# Altium schematic sheet analog_voltage_outputs.schdoc
size A3; Organization: Altium Limited; Address1: L3, 12a Rodborough Rd; Address2: Frenchs Forest; Address3: NSW; Address4: Australia 2086
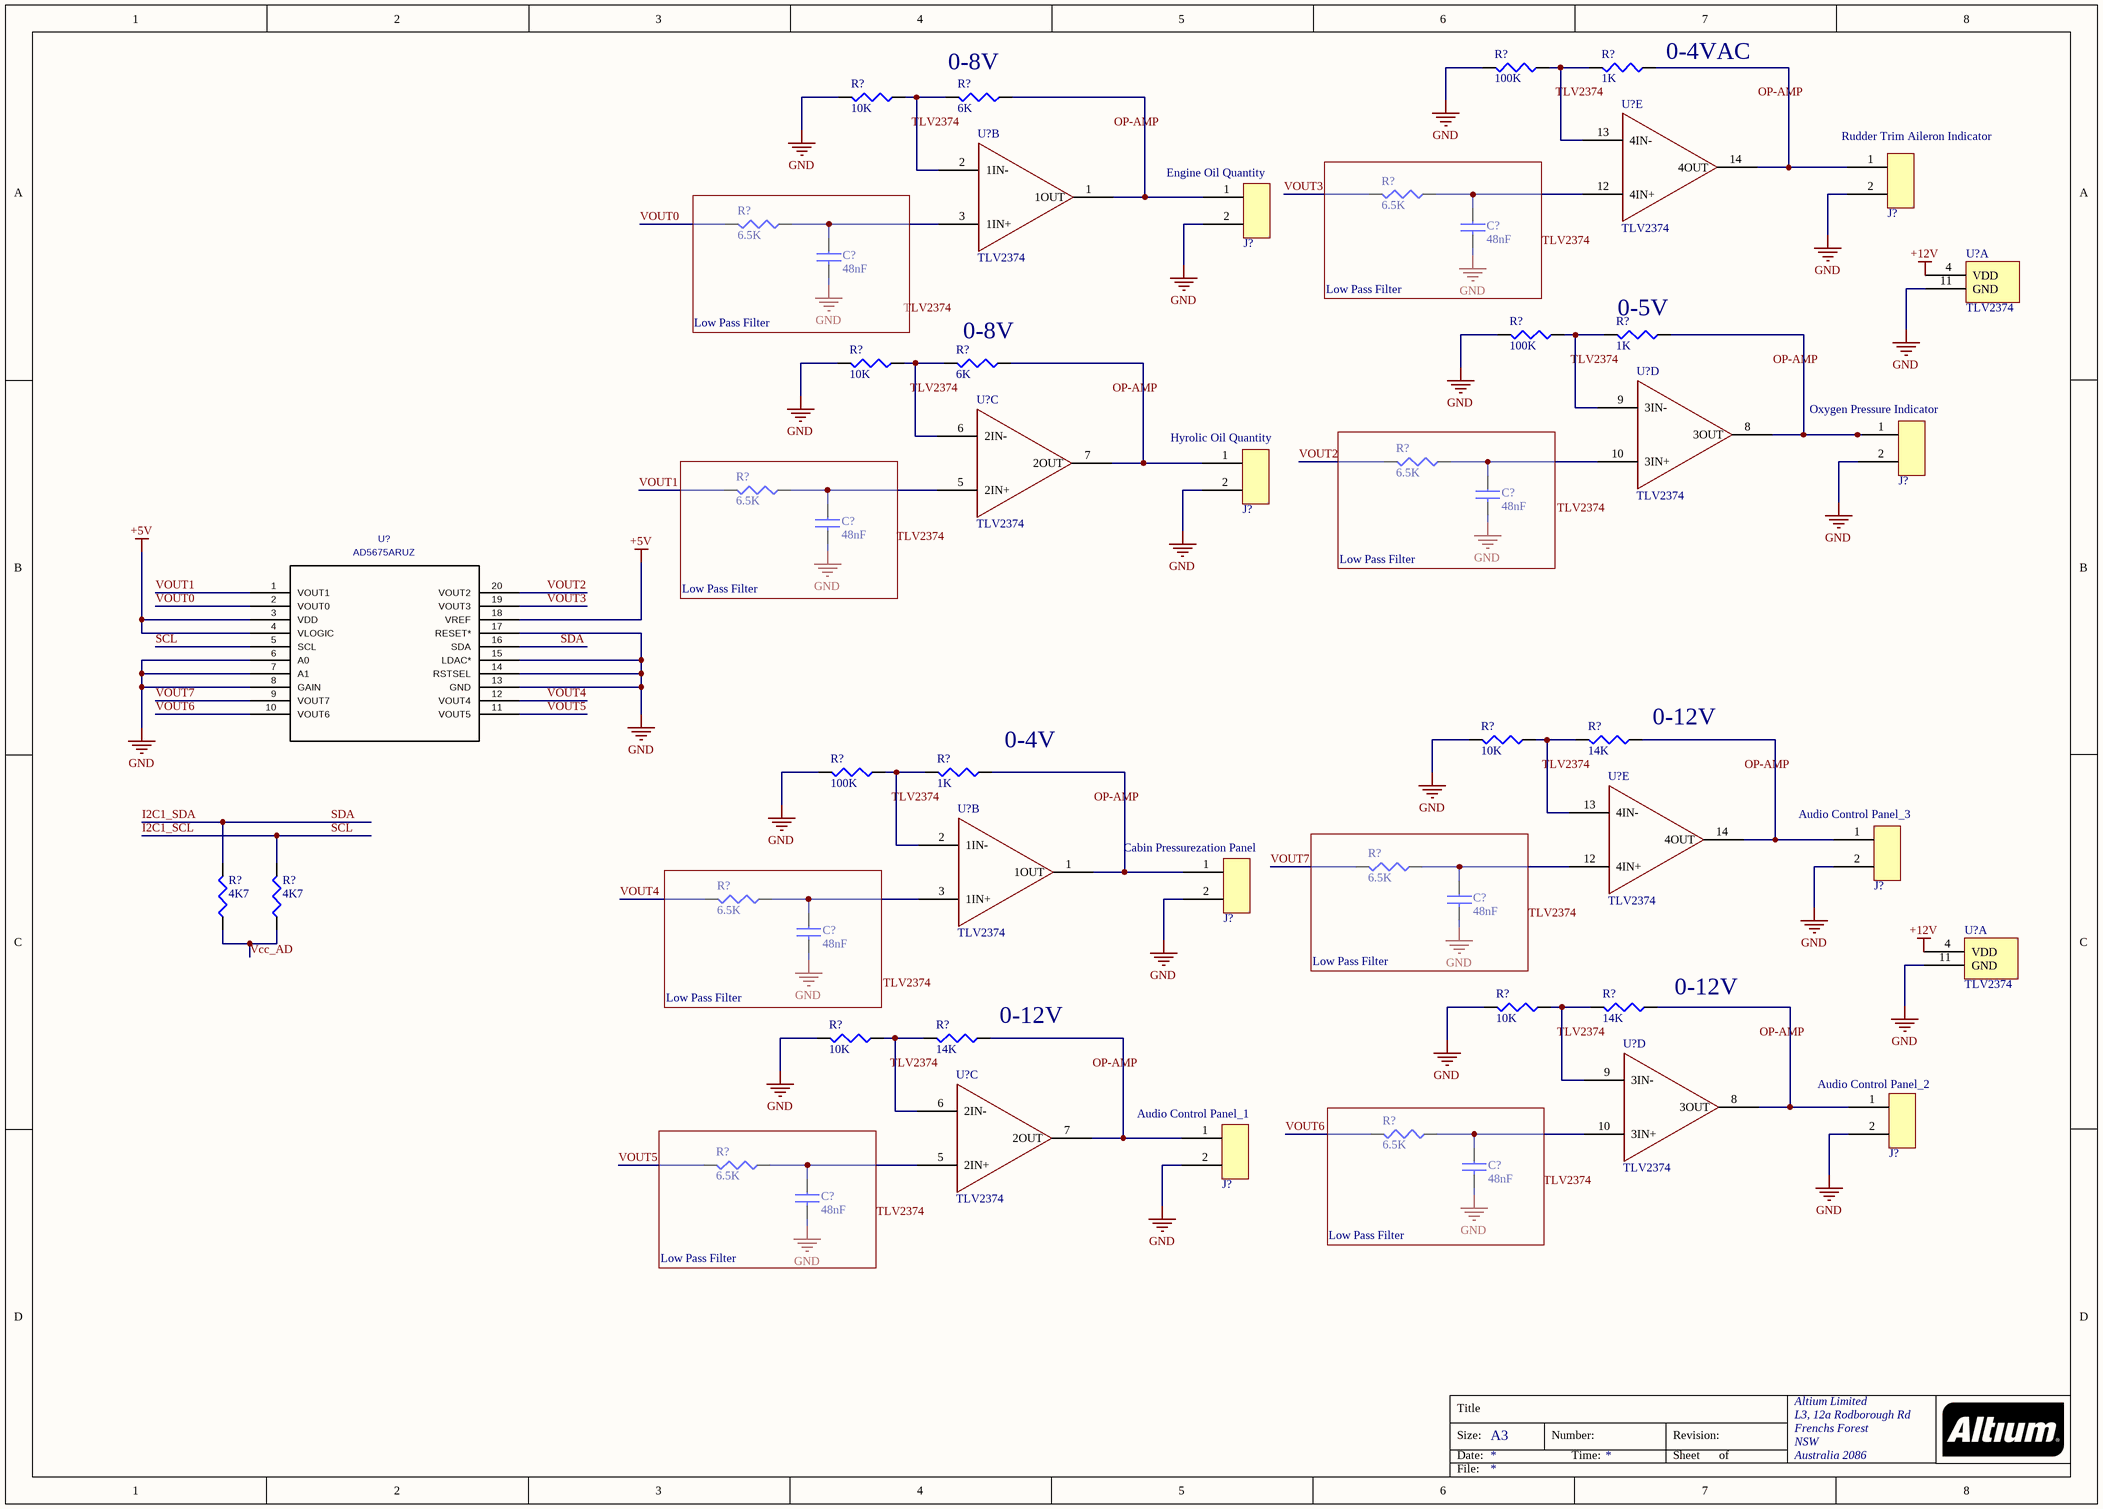
[diagram p0: analog_voltage_outputs.schdoc]

## Parts
(Parts that share a designator on the sheet are numbered #1, #2 ... from top to bottom, then left to right.)
C?#1  value 48nF  [0805 SMD Ceramic Capacitor]  (hidden comment: C0805C333)
C?#2  value 48nF  [0805 SMD Ceramic Capacitor]  (hidden comment: C0805C333)
C?#3  value 48nF  [0805 SMD Ceramic Capacitor]  (hidden comment: C0805C333)
C?#4  value 48nF  [0805 SMD Ceramic Capacitor]  (hidden comment: C0805C333)
C?#5  value 48nF  [0805 SMD Ceramic Capacitor]  (hidden comment: C0805C333)
C?#6  value 48nF  [0805 SMD Ceramic Capacitor]  (hidden comment: C0805C333)
C?#7  value 48nF  [0805 SMD Ceramic Capacitor]  (hidden comment: C0805C333)
C?#8  value 48nF  [0805 SMD Ceramic Capacitor]  (hidden comment: C0805C333)
J?#1  2x Terminal  [2x Terminal mini]  (value not drawn)
J?#2  2x Terminal  [2x Terminal mini]  (value not drawn)
J?#3  2x Terminal  [2x Terminal mini]  (value not drawn)
J?#4  2x Terminal  [2x Terminal mini]  (value not drawn)
J?#5  2x Terminal  [2x Terminal mini]  (value not drawn)
J?#6  2x Terminal  [2x Terminal mini]  (value not drawn)
J?#7  2x Terminal  [2x Terminal mini]  (value not drawn)
J?#8  2x Terminal  [2x Terminal mini]  (value not drawn)
R?#1  value 100K  [0805 Resistor]  (hidden comment: 0805_1K)
R?#2  value 1K  [0805 Resistor]  (hidden comment: 0805_1K)
R?#3  value 10K  [0805 Resistor]  (hidden comment: 0805_1K)
R?#4  value 6K  [0805 Resistor]  (hidden comment: 0805_1K)
R?#5  value 6.5K  [0805 Resistor]  (hidden comment: 0805_1K)
R?#6  value 6.5K  [0805 Resistor]  (hidden comment: 0805_1K)
R?#7  value 100K  [0805 Resistor]  (hidden comment: 0805_1K)
R?#8  value 1K  [0805 Resistor]  (hidden comment: 0805_1K)
R?#9  value 10K  [0805 Resistor]  (hidden comment: 0805_1K)
R?#10  value 6K  [0805 Resistor]  (hidden comment: 0805_1K)
R?#11  value 6.5K  [0805 Resistor]  (hidden comment: 0805_1K)
R?#12  value 6.5K  [0805 Resistor]  (hidden comment: 0805_1K)
R?#13  value 10K  [0805 Resistor]  (hidden comment: 0805_1K)
R?#14  value 14K  [0805 Resistor]  (hidden comment: 0805_1K)
R?#15  value 100K  [0805 Resistor]  (hidden comment: 0805_1K)
R?#16  value 1K  [0805 Resistor]  (hidden comment: 0805_1K)
R?#17  value 6.5K  [0805 Resistor]  (hidden comment: 0805_1K)
R?#18  value 6.5K  [0805 Resistor]  (hidden comment: 0805_1K)
R?#19  value 4K7  [0805 Resistor]  (hidden comment: 0805_4K7%1)
R?#20  value 4K7  [0805 Resistor]  (hidden comment: 0805_4K7%1)
R?#21  value 10K  [0805 Resistor]  (hidden comment: 0805_1K)
R?#22  value 14K  [0805 Resistor]  (hidden comment: 0805_1K)
R?#23  value 10K  [0805 Resistor]  (hidden comment: 0805_1K)
R?#24  value 14K  [0805 Resistor]  (hidden comment: 0805_1K)
R?#25  value 6.5K  [0805 Resistor]  (hidden comment: 0805_1K)
R?#26  value 6.5K  [0805 Resistor]  (hidden comment: 0805_1K)
U?#1  TLV2374  [SO14]  (part E of 5)
U?#2  TLV2374  [SO14]  (part B of 5)
U?#3  TLV2374  [SO14]  (part A of 5)
U?#4  TLV2374  [SO14]  (part D of 5)
U?#5  TLV2374  [SO14]  (part C of 5)
U?#6  AD5675ARUZ  [RU_20]
U?#7  TLV2374  [SO14]  (part E of 5)
U?#8  TLV2374  [SO14]  (part B of 5)
U?#9  TLV2374  [SO14]  (part A of 5)
U?#10  TLV2374  [SO14]  (part D of 5)
U?#11  TLV2374  [SO14]  (part C of 5)

## Blocks framed on the sheet
Low Pass Filter: C?#1 R?#5
Low Pass Filter: C?#2 R?#6
Low Pass Filter: C?#3 R?#11
Low Pass Filter: C?#4 R?#12
Low Pass Filter: C?#6 R?#18
Low Pass Filter: C?#5 R?#17
Low Pass Filter: C?#8 R?#26
Low Pass Filter: C?#7 R?#25

## Nets
+5V: U?#6.3(VDD) U?#6.4(VLOGIC) U?#6.18(VREF)
+12V: U?#3.4(VDD) U?#9.4(VDD)
GND: C?#1.2 C?#2.2 C?#3.2 C?#4.2 C?#5.2 C?#6.2 C?#7.2 C?#8.2 J?#1.2 J?#2.2 J?#3.2 J?#4.2 J?#5.2 J?#6.2 J?#7.2 J?#8.2 R?#1.2 R?#3.2 R?#7.2 R?#9.2 R?#13.2 R?#15.2 R?#21.2 R?#23.2 U?#3.11(GND) U?#6.6(A0) U?#6.7(A1) U?#6.8(GAIN) U?#6.13(GND) U?#6.14(RSTSEL) U?#6.15(LDAC*) U?#6.17(RESET*) U?#9.11(GND)
I2C1_SCL: R?#20.2 U?#6.5(SCL)  [also labelled SCL]
I2C1_SDA: R?#19.2 U?#6.16(SDA)  [also labelled SDA]
Vcc_AD: R?#19.1 R?#20.1
VOUT0: R?#6.2 U?#6.2(VOUT0)
VOUT1: R?#12.2 U?#6.1(VOUT1)
VOUT2: R?#11.2 U?#6.20(VOUT2)
VOUT3: R?#5.2 U?#6.19(VOUT3)
VOUT4: R?#18.2 U?#6.12(VOUT4)
VOUT5: R?#26.2 U?#6.11(VOUT5)
VOUT6: R?#25.2 U?#6.10(VOUT6)
VOUT7: R?#17.2 U?#6.9(VOUT7)
NetC?#1_1: C?#1.1 R?#5.1 U?#1.12(4IN+)
NetC?#2_1: C?#2.1 R?#6.1 U?#2.3(1IN+)
NetC?#3_1: C?#3.1 R?#11.1 U?#4.10(3IN+)
NetC?#4_1: C?#4.1 R?#12.1 U?#5.5(2IN+)
NetC?#5_1: C?#5.1 R?#17.1 U?#7.12(4IN+)
NetC?#6_1: C?#6.1 R?#18.1 U?#8.3(1IN+)
NetC?#7_1: C?#7.1 R?#25.1 U?#10.10(3IN+)
NetC?#8_1: C?#8.1 R?#26.1 U?#11.5(2IN+)
NetJ?#1_1: J?#1.1 R?#2.1 U?#1.14(4OUT)
NetJ?#2_1: J?#2.1 R?#4.1 U?#2.1(1OUT)
NetJ?#3_1: J?#3.1 R?#8.1 U?#4.8(3OUT)
NetJ?#4_1: J?#4.1 R?#10.1 U?#5.7(2OUT)
NetJ?#5_1: J?#5.1 R?#14.1 U?#7.14(4OUT)
NetJ?#6_1: J?#6.1 R?#16.1 U?#8.1(1OUT)
NetJ?#7_1: J?#7.1 R?#22.1 U?#10.8(3OUT)
NetJ?#8_1: J?#8.1 R?#24.1 U?#11.7(2OUT)
NetR?#1_1: R?#1.1 R?#2.2 U?#1.13(4IN-)
NetR?#3_1: R?#3.1 R?#4.2 U?#2.2(1IN-)
NetR?#7_1: R?#7.1 R?#8.2 U?#4.9(3IN-)
NetR?#9_1: R?#9.1 R?#10.2 U?#5.6(2IN-)
NetR?#13_1: R?#13.1 R?#14.2 U?#7.13(4IN-)
NetR?#15_1: R?#15.1 R?#16.2 U?#8.2(1IN-)
NetR?#21_1: R?#21.1 R?#22.2 U?#10.9(3IN-)
NetR?#23_1: R?#23.1 R?#24.2 U?#11.6(2IN-)

## Notes on the sheet
- (near R?#4) 0-8V
- (near R?#2) 0-4VAC
- (near J?#2) Engine Oil Quantity
- (near J?#1) Rudder Trim Aileron Indicator
- (near R?#8) 0-5V
- (near R?#10) 0-8V
- (near J?#4) Hyrolic Oil Quantity
- (near J?#3) Oxygen Pressure Indicator
- (near R?#16) 0-4V
- (near R?#14) 0-12V
- (near J?#6) Cabin Pressurezation Panel
- (near J?#5) Audio Control Panel_3
- (near R?#24) 0-12V
- (near R?#22) 0-12V
- (near J?#8) Audio Control Panel_1
- (near J?#7) Audio Control Panel_2
- Labels drawn without touching a wire or pin: OP-AMP, TLV2374
- Title
- Size:
- Date:
- A3
- Number:
- Time:
- Revision:
- Sheet
- of
- File:

## Library data of the parts
C?#1-C?#8 = C0805C333: Manufacturer Code: MC0805B333K500CT; Manufacturer: MULTICOMP; Voltage: 50V; Tolerace: ± 10%; Farnell Code: 1759257; Unit Price: 0,022 €; MOQ: 10; Package: 0805
J?#1-J?#8 = 2x Terminal: Manufacturer: WEIDMULLER; Manufacturer Code: PM5.08/2/90 BLK; Value: 2x Terminal; Farnell Code: 1131855; Unit Price: 0,55 €
R?#1-R?#18 R?#21-R?#26 = 0805_1K: Manufacturer Code: MC01W080511K; Manufacturer: MULTICOMP; Tolerance: ±1%; Farnell Code: 9332383; Unit Price: 0,03 €
R?#19 R?#20 = 0805_4K7%1: Manufacturer Code: PCF0805P-R-4K7-BT1; Manufacturer: WELWYN; Tolerance: ±0.1%; Temperature Coefficient: ±25ppm/°C; Power Rating: 100mW; Unit Price: 0,34; Farnell Code: 1506096; MOQ: 5
U?#1-U?#5 U?#7-U?#11 = TLV2374: Manufacturer Code: TLV2374ID; Manufacturer: Texas Instruments; Farnell Code: 8455040; Unit Price: 1,07 €; Value: TLV2374
U?#6 = AD5675ARUZ: Vendor: Analog Devices Inc; Built_By: Analog Devices Inc.; Value: AD5675ARUZ; Manufacturer_Part_Number: AD5675ARUZ